# EAGLE schematic dualwbo (EAGLE 9.1.1)

## Sheet 1 of 8: MCU
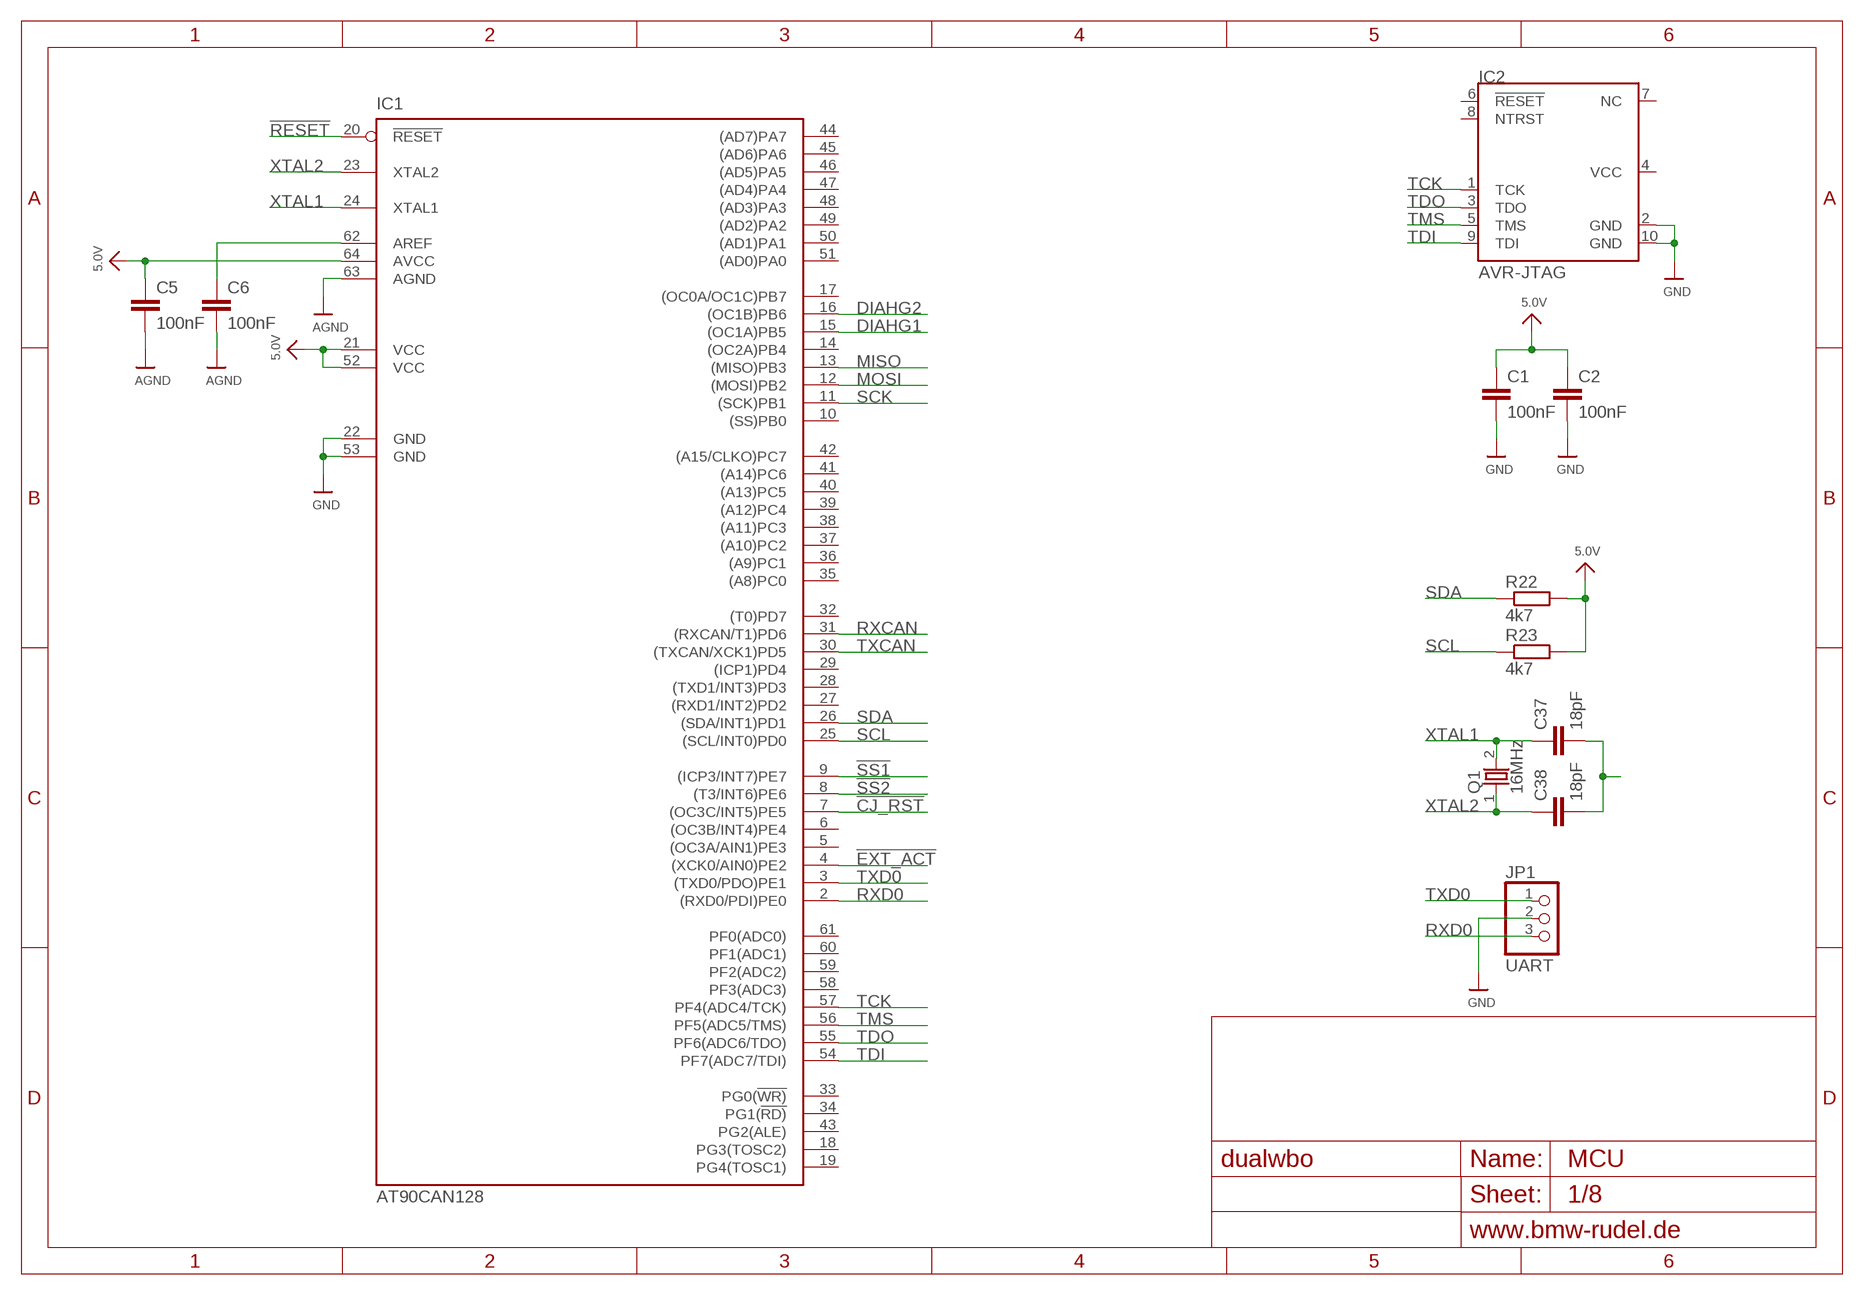
[diagram p0: schematic, sheet 1]

### Parts
C1  100nF  C-EUC0805  [C0805]
C2  100nF  C-EUC0805  [C0805]
C5  100nF  C-EUC0805  [C0805]
C6  100nF  C-EUC0805  [C0805]
C37  18pF  C-EUC0805  [C0805]
C38  18pF  C-EUC0805  [C0805]
IC1  AT90CAN128  [TQFP64]
IC2  AVR-JTAG  [2X05_1.27MM_SMT]
JP1  UART  PINHD-1X3  [1X03]
Q1  16MHz  ABM7  [ABM7]
R22  4k7  R-EU_R0805  [R0805]
R23  4k7  R-EU_R0805  [R0805]

### Nets
5.0V: C1.1 C2.1 C5.1 IC1.21(VCC) IC1.52(VCC) IC1.64(AVCC) R22.2 R23.2 ; also sheet 2,3,5,6,7
!CJ_RST: IC1.7((OC3C/INT5)PE5) ; also sheet 5,6
!EXT_ACT: IC1.4((XCK0/AIN0)PE2) ; also sheet 3
!RESET: IC1.20(!RESET) ; also sheet 3
!SS1: IC1.9((ICP3/INT7)PE7) ; also sheet 5
!SS2: IC1.8((T3/INT6)PE6) ; also sheet 6
AGND: C5.2 C6.2 IC1.63(AGND) ; also sheet 3,5,6,7
DIAHG1: IC1.15((OC1A)PB5) ; also sheet 4,5
DIAHG2: IC1.16((OC1B)PB6) ; also sheet 4,6
GND: C1.2 C2.2 IC1.22(GND) IC1.53(GND) IC2.2(GND) IC2.10(GND) JP1.2 ; also sheet 2,3,4,5,6,7,8
MISO: IC1.13((MISO)PB3) ; also sheet 5,6
MOSI: IC1.12((MOSI)PB2) ; also sheet 5,6
N$26: C6.1 IC1.62(AREF)
N$30: C37.2 C38.2
RXCAN: IC1.31((RXCAN/T1)PD6) ; also sheet 2
RXD0: IC1.2((RXD0/PDI)PE0) JP1.3
SCK: IC1.11((SCK)PB1) ; also sheet 5,6
SCL: IC1.25((SCL/INT0)PD0) R23.1 ; also sheet 7
SDA: IC1.26((SDA/INT1)PD1) R22.1 ; also sheet 7
TCK: IC1.57(PF4(ADC4/TCK)) IC2.1(TCK)
TDI: IC1.54(PF7(ADC7/TDI)) IC2.9(TDI)
TDO: IC1.55(PF6(ADC6/TDO)) IC2.3(TDO)
TMS: IC1.56(PF5(ADC5/TMS)) IC2.5(TMS)
TXCAN: IC1.30((TXCAN/XCK1)PD5) ; also sheet 2
TXD0: IC1.3((TXD0/PDO)PE1) JP1.1
XTAL1: C37.1 IC1.24(XTAL1) Q1.2
XTAL2: C38.1 IC1.23(XTAL2) Q1.1
Unconnected: IC1.5((OC3A/AIN1)PE3) IC1.6((OC3B/INT4)PE4) IC1.10((SS)PB0) IC1.14((OC2A)PB4) IC1.17((OC0A/OC1C)PB7) IC1.18(PG3(TOSC2)) IC1.19(PG4(TOSC1)) IC1.27((RXD1/INT2)PD2) IC1.28((TXD1/INT3)PD3) IC1.29((ICP1)PD4) IC1.32((T0)PD7) IC1.33(PG0(!WR)) IC1.34(PG1(!RD)) IC1.35((A8)PC0) IC1.36((A9)PC1) IC1.37((A10)PC2) IC1.38((A11)PC3) IC1.39((A12)PC4) IC1.40((A13)PC5) IC1.41((A14)PC6) IC1.42((A15/CLKO)PC7) IC1.43(PG2(ALE)) IC1.44((AD7)PA7) IC1.45((AD6)PA6) IC1.46((AD5)PA5) IC1.47((AD4)PA4) IC1.48((AD3)PA3) IC1.49((AD2)PA2) IC1.50((AD1)PA1) IC1.51((AD0)PA0) IC1.58(PF3(ADC3)) IC1.59(PF2(ADC2)) IC1.60(PF1(ADC1)) IC1.61(PF0(ADC0)) IC2.4(VCC) IC2.6(!RESET) IC2.7(NC) IC2.8(NTRST)

## Sheet 2 of 8: CAN
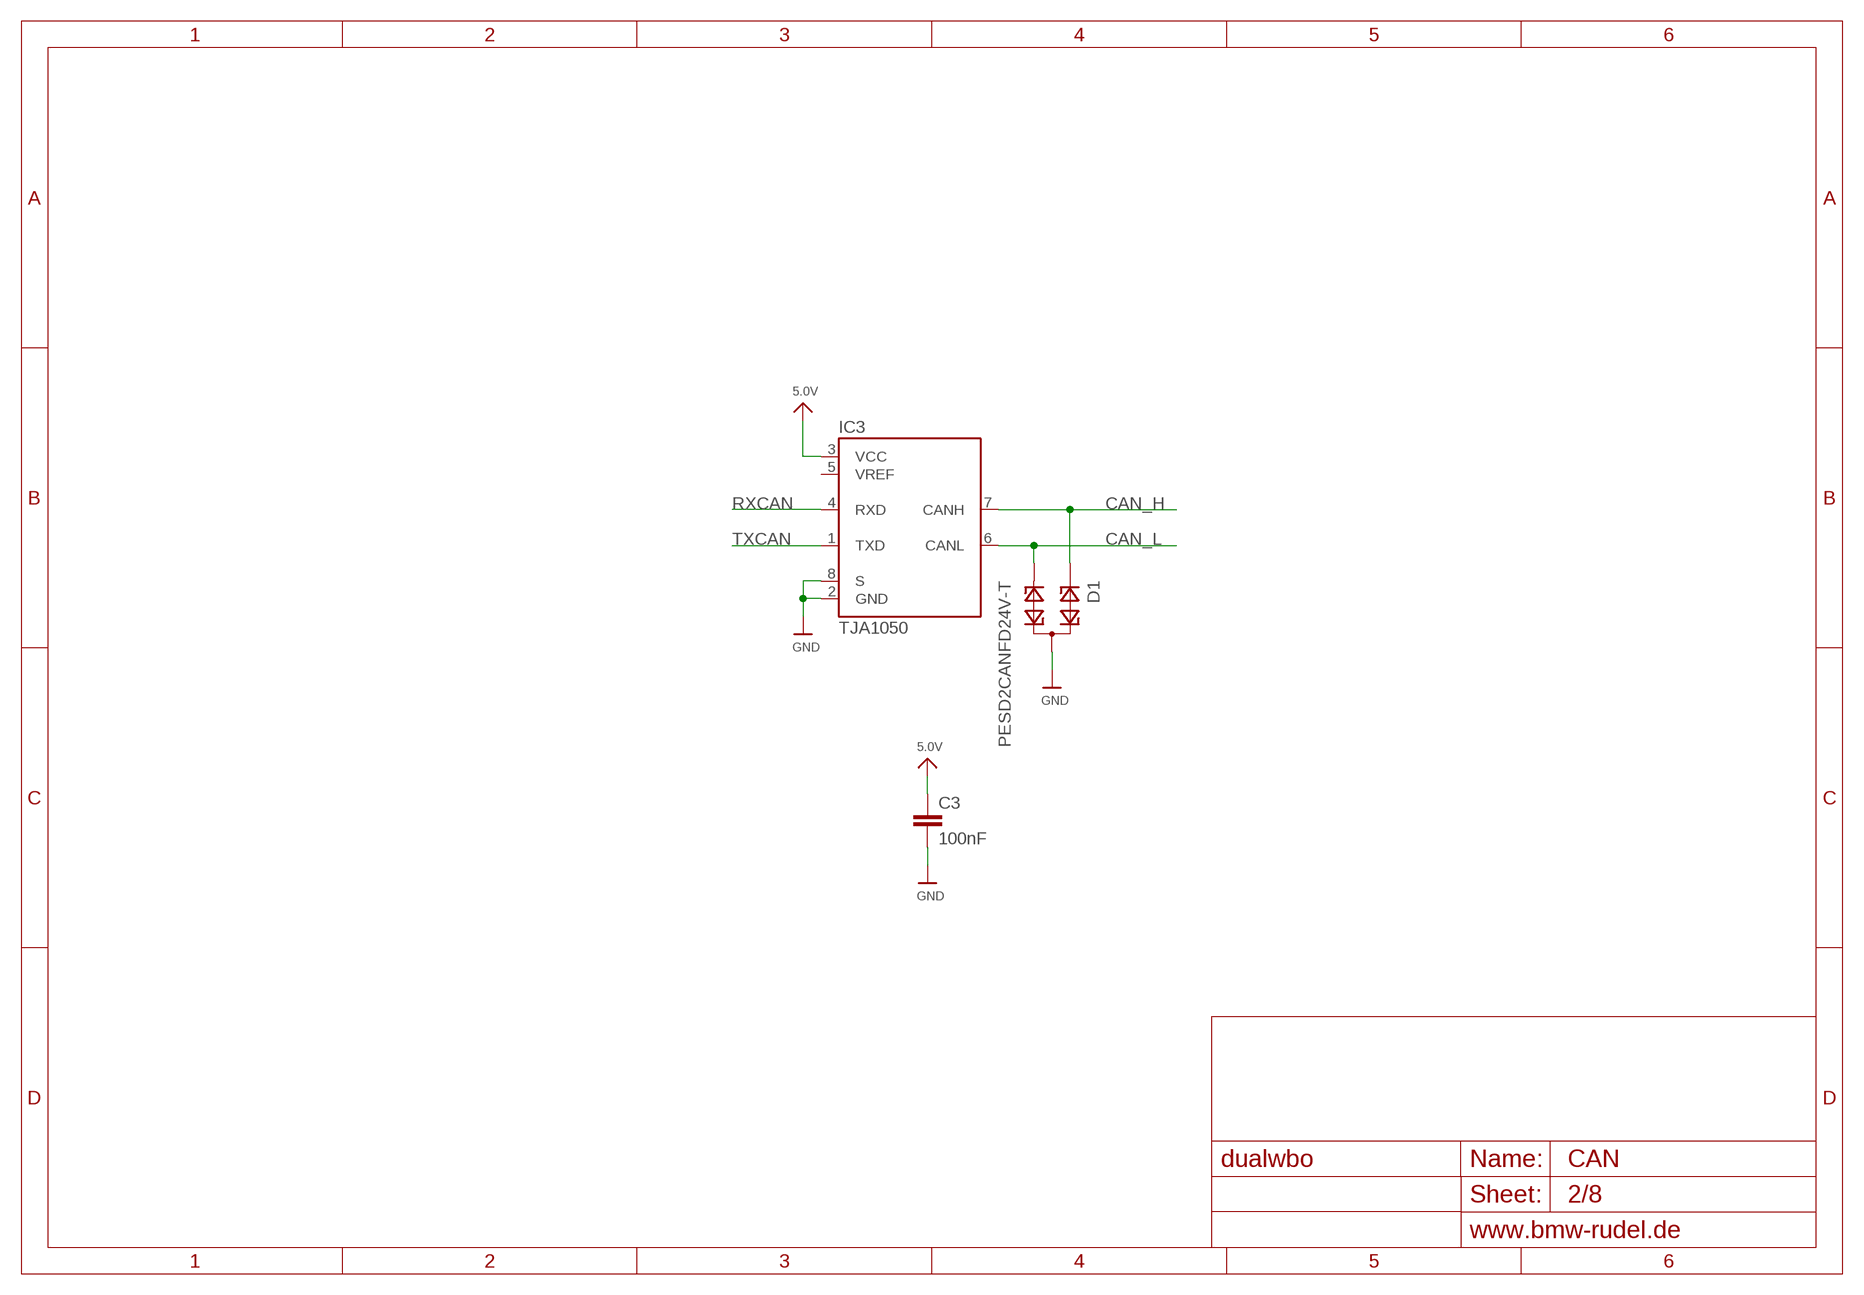
[diagram p1: schematic, sheet 2]

### Parts
C3  100nF  C-EUC0805  [C0805]
D1  PESD2CANFD24V-T  [SOT23]
IC3  TJA1050  [SO8]

### Nets
5.0V: C3.1 IC3.3(VCC) ; also sheet 1,3,5,6,7
CAN_H: D1.1 IC3.7(CANH) ; also sheet 8
CAN_L: D1.2 IC3.6(CANL) ; also sheet 8
GND: C3.2 D1.3 IC3.2(GND) IC3.8(S) ; also sheet 1,3,4,5,6,7,8
RXCAN: IC3.4(RXD) ; also sheet 1
TXCAN: IC3.1(TXD) ; also sheet 1
Unconnected: IC3.5(VREF)

## Sheet 3 of 8: POWER
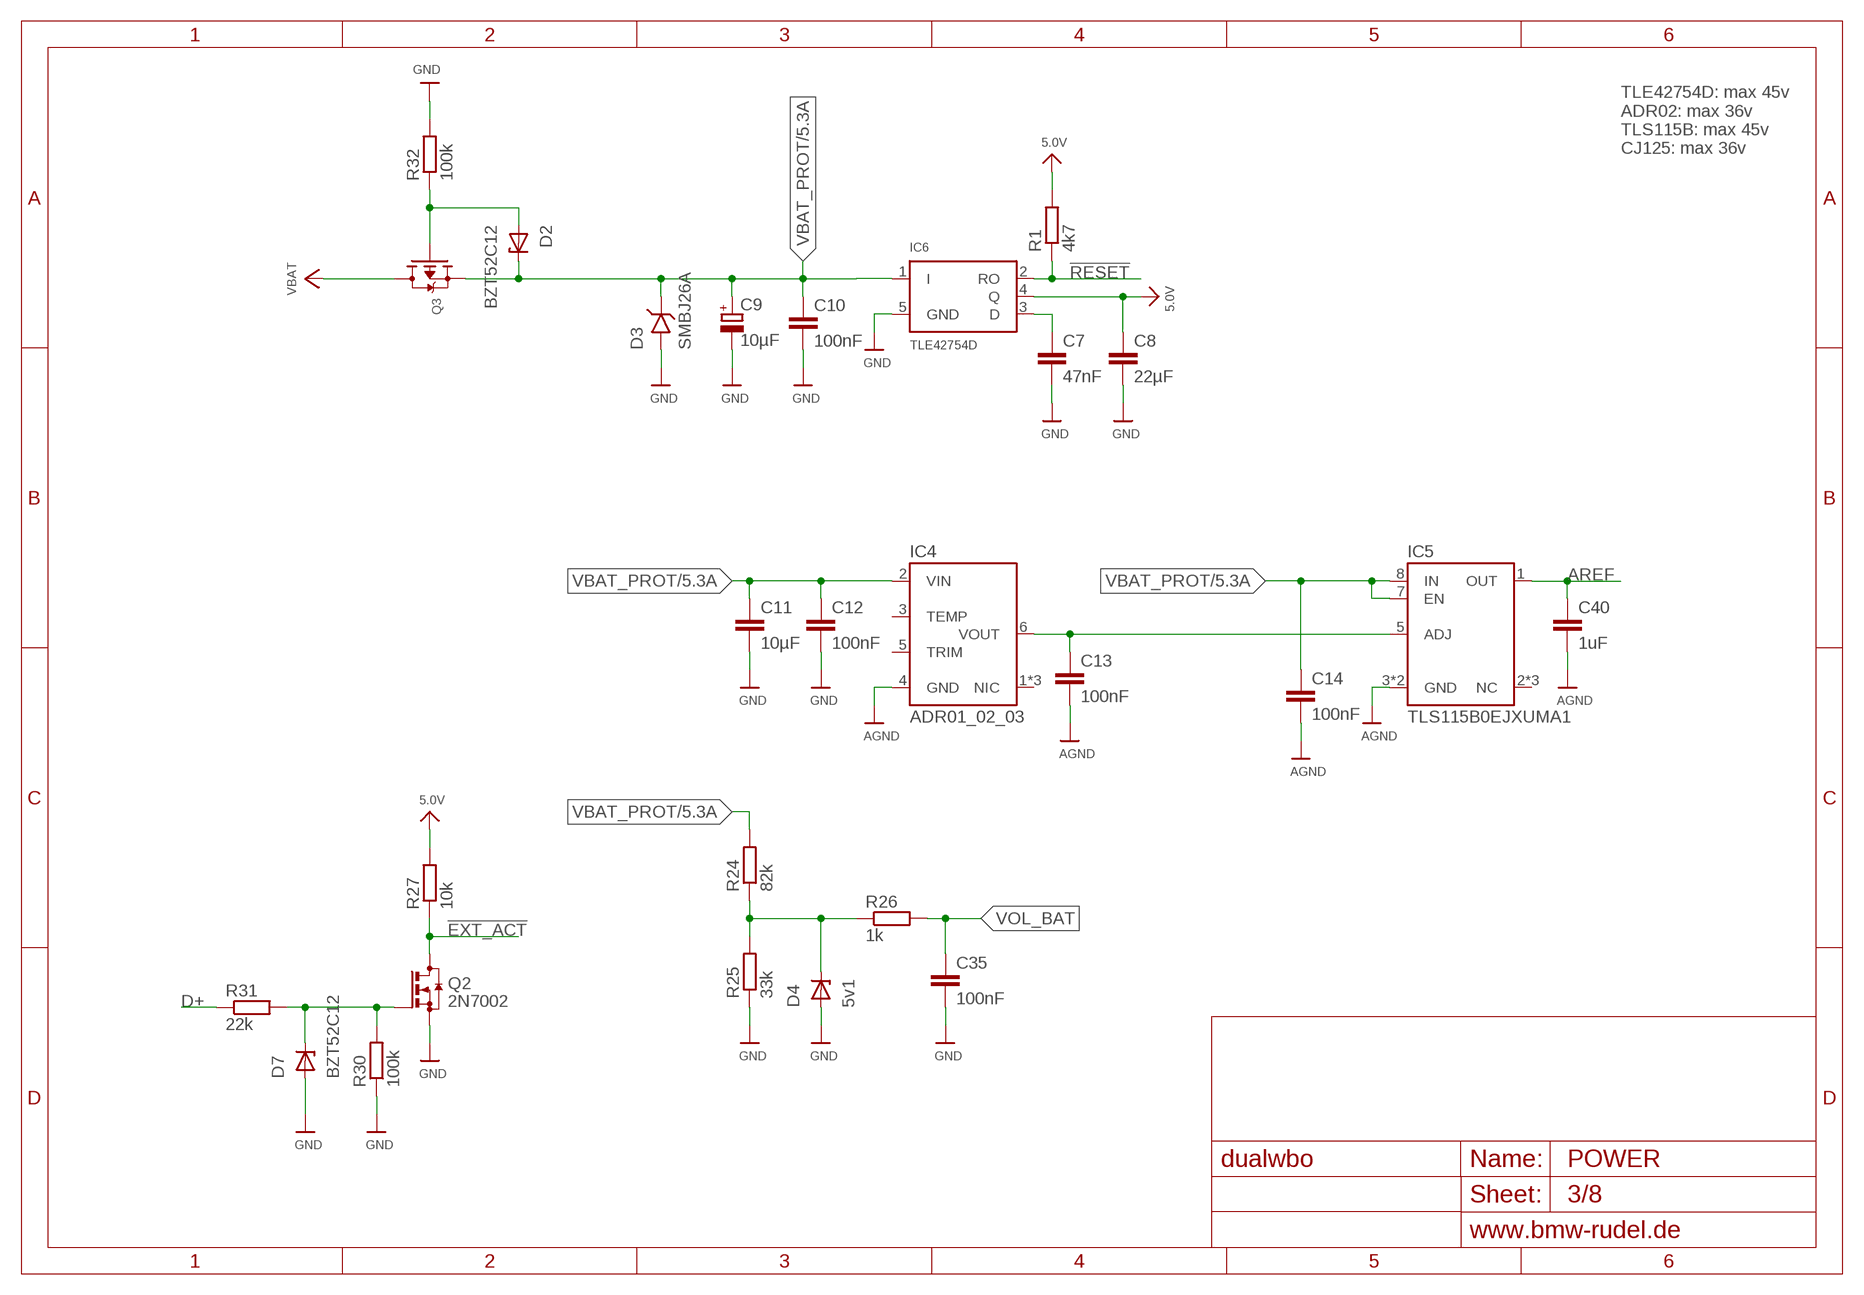
[diagram p2: schematic, sheet 3]

### Parts
C7  47nF  C-EUC0805  [C0805]
C8  22µF  C-EUC0805  [C0805]
C9  10µF  CPOL-EUD  [PANASONIC_D]
C10  100nF  C-EUC0805  [C0805]
C11  10µF  C-EUC0805  [C0805]
C12  100nF  C-EUC0805  [C0805]
C13  100nF  C-EUC0805  [C0805]
C14  100nF  C-EUC0805  [C0805]
C35  100nF  C-EUC0805  [C0805]
C40  1uF  C-EUC0805  [C0805]
D2  BZT52C12  Z-DIODESOD123  [SOD-123]
D3  SMBJ26A  P6SMBXXASMB  [DO-214AA]
D4  5v1  Z-DIODESMB  [SMB]
D7  BZT52C12  Z-DIODESOD123  [SOD-123]
IC4  ADR01_02_03  [SOIC8]
IC5  TLS115B0EJXUMA1  [PG-DSO-8]
IC6  TLE42754D  [TO252-51]
Q2  2N7002  BSS123  [SOT-23]
Q3  MOSFET-P  [SOT23-R]
R1  4k7  R-EU_R0805  [R0805]
R24  82k  R-EU_R0805  [R0805]
R25  33k  R-EU_R0805  [R0805]
R26  1k  R-EU_R0805  [R0805]
R27  10k  R-EU_R0805  [R0805]
R30  100k  R-EU_R0805  [R0805]
R31  22k  R-EU_R0805  [R0805]
R32  100k  R-EU_R0805  [R0805]

### Nets
5.0V: C8.1 IC6.4(Q) R1.2 R27.2 ; also sheet 1,2,5,6,7
!EXT_ACT: Q2.3(D) R27.1 ; also sheet 1
!RESET: IC6.2(RO) R1.1 ; also sheet 1
AGND: C13.2 C14.2 C40.2 IC4.4(GND) IC5.3(GND) IC5.9(GND) ; also sheet 1,5,6,7
AREF: C40.1 IC5.1(OUT) ; also sheet 5,6,7
D+: R31.1 ; also sheet 8
GND: C7.2 C8.2 C9.- C10.2 C11.2 C12.2 C35.2 D3.P$2(A) D4.A D7.A IC6.5(GND) Q2.2(S) R25.1 R30.1 R32.2 ; also sheet 1,2,4,5,6,7,8
N$1: C13.1 IC4.6(VOUT) IC5.5(ADJ)
N$4: C7.1 IC6.3(D)
N$28: D4.C R24.1 R25.2 R26.1
N$29: D7.C Q2.1(G) R30.2 R31.2
N$32: D2.A Q3.1(G) R32.1
VBAT: Q3.3(D) ; also sheet 8
VBAT_PROT: C9.+ C10.1 C11.1 C12.1 C14.1 D2.C D3.P$1(C) IC4.2(VIN) IC5.7(EN) IC5.8(IN) IC6.1(I) Q3.2(S) R24.2 ; also sheet 5,6
VOL_BAT: C35.1 R26.2 ; also sheet 7
Unconnected: IC4.1(NIC) IC4.3(TEMP) IC4.5(TRIM) IC4.7(NIC) IC4.8(NIC) IC5.2(NC) IC5.4(NC) IC5.6(NC)

### Notes on the sheet
- TLE42754D: max 45v
  ADR02: max 36v
  TLS115B: max 45v
  CJ125: max 36v

## Sheet 4 of 8: HEATER
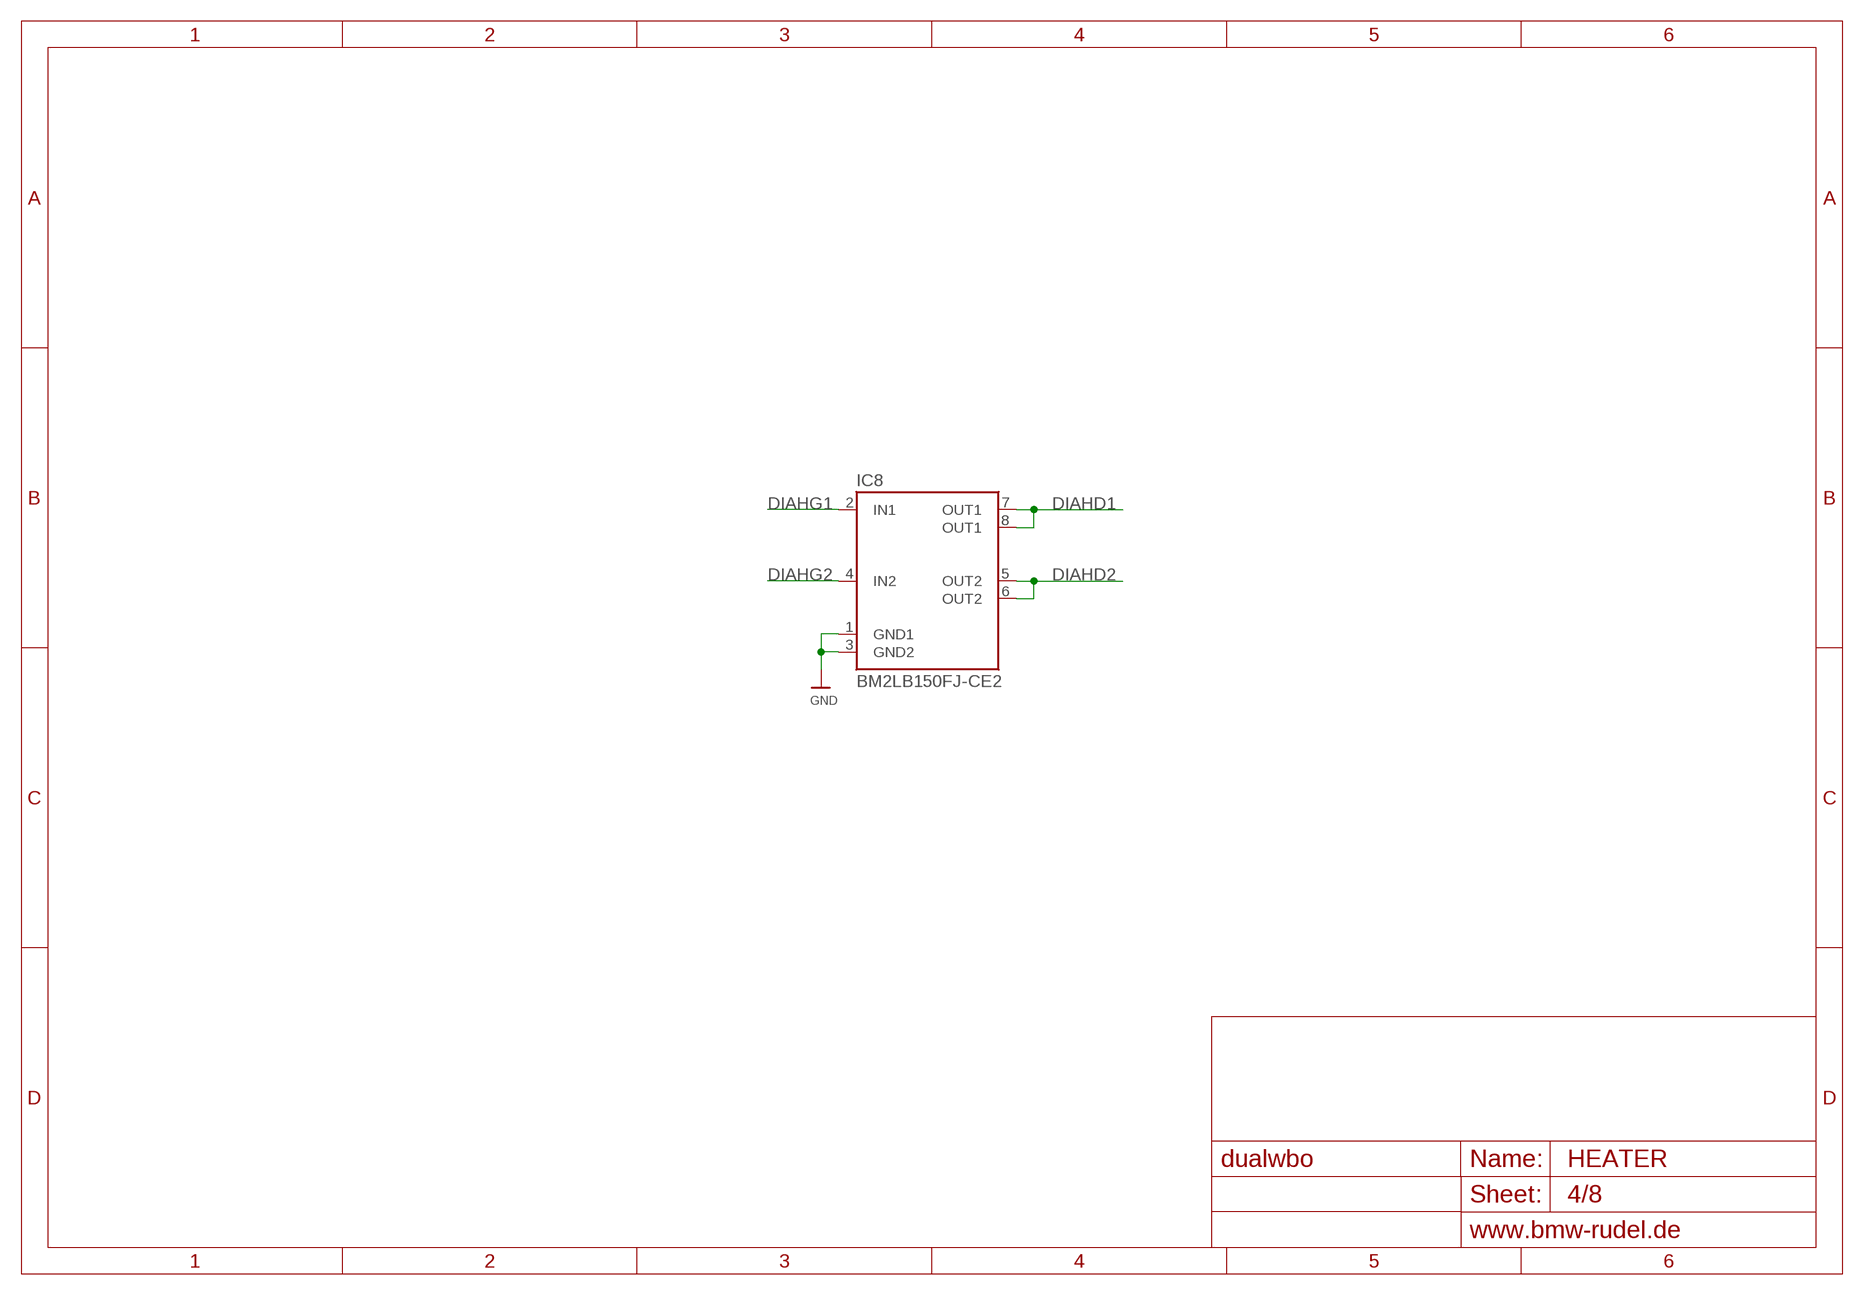
[diagram p3: schematic, sheet 4]

### Parts
IC8  BM2LB150FJ-CE2  [SOIC127P600X165-8N]

### Nets
DIAHD1: IC8.7(OUT1) IC8.8(OUT1) ; also sheet 5
DIAHD2: IC8.5(OUT2) IC8.6(OUT2) ; also sheet 6
DIAHG1: IC8.2(IN1) ; also sheet 1,5
DIAHG2: IC8.4(IN2) ; also sheet 1,6
GND: IC8.1(GND1) IC8.3(GND2) ; also sheet 1,2,3,5,6,7,8

## Sheet 5 of 8: CJ125#1
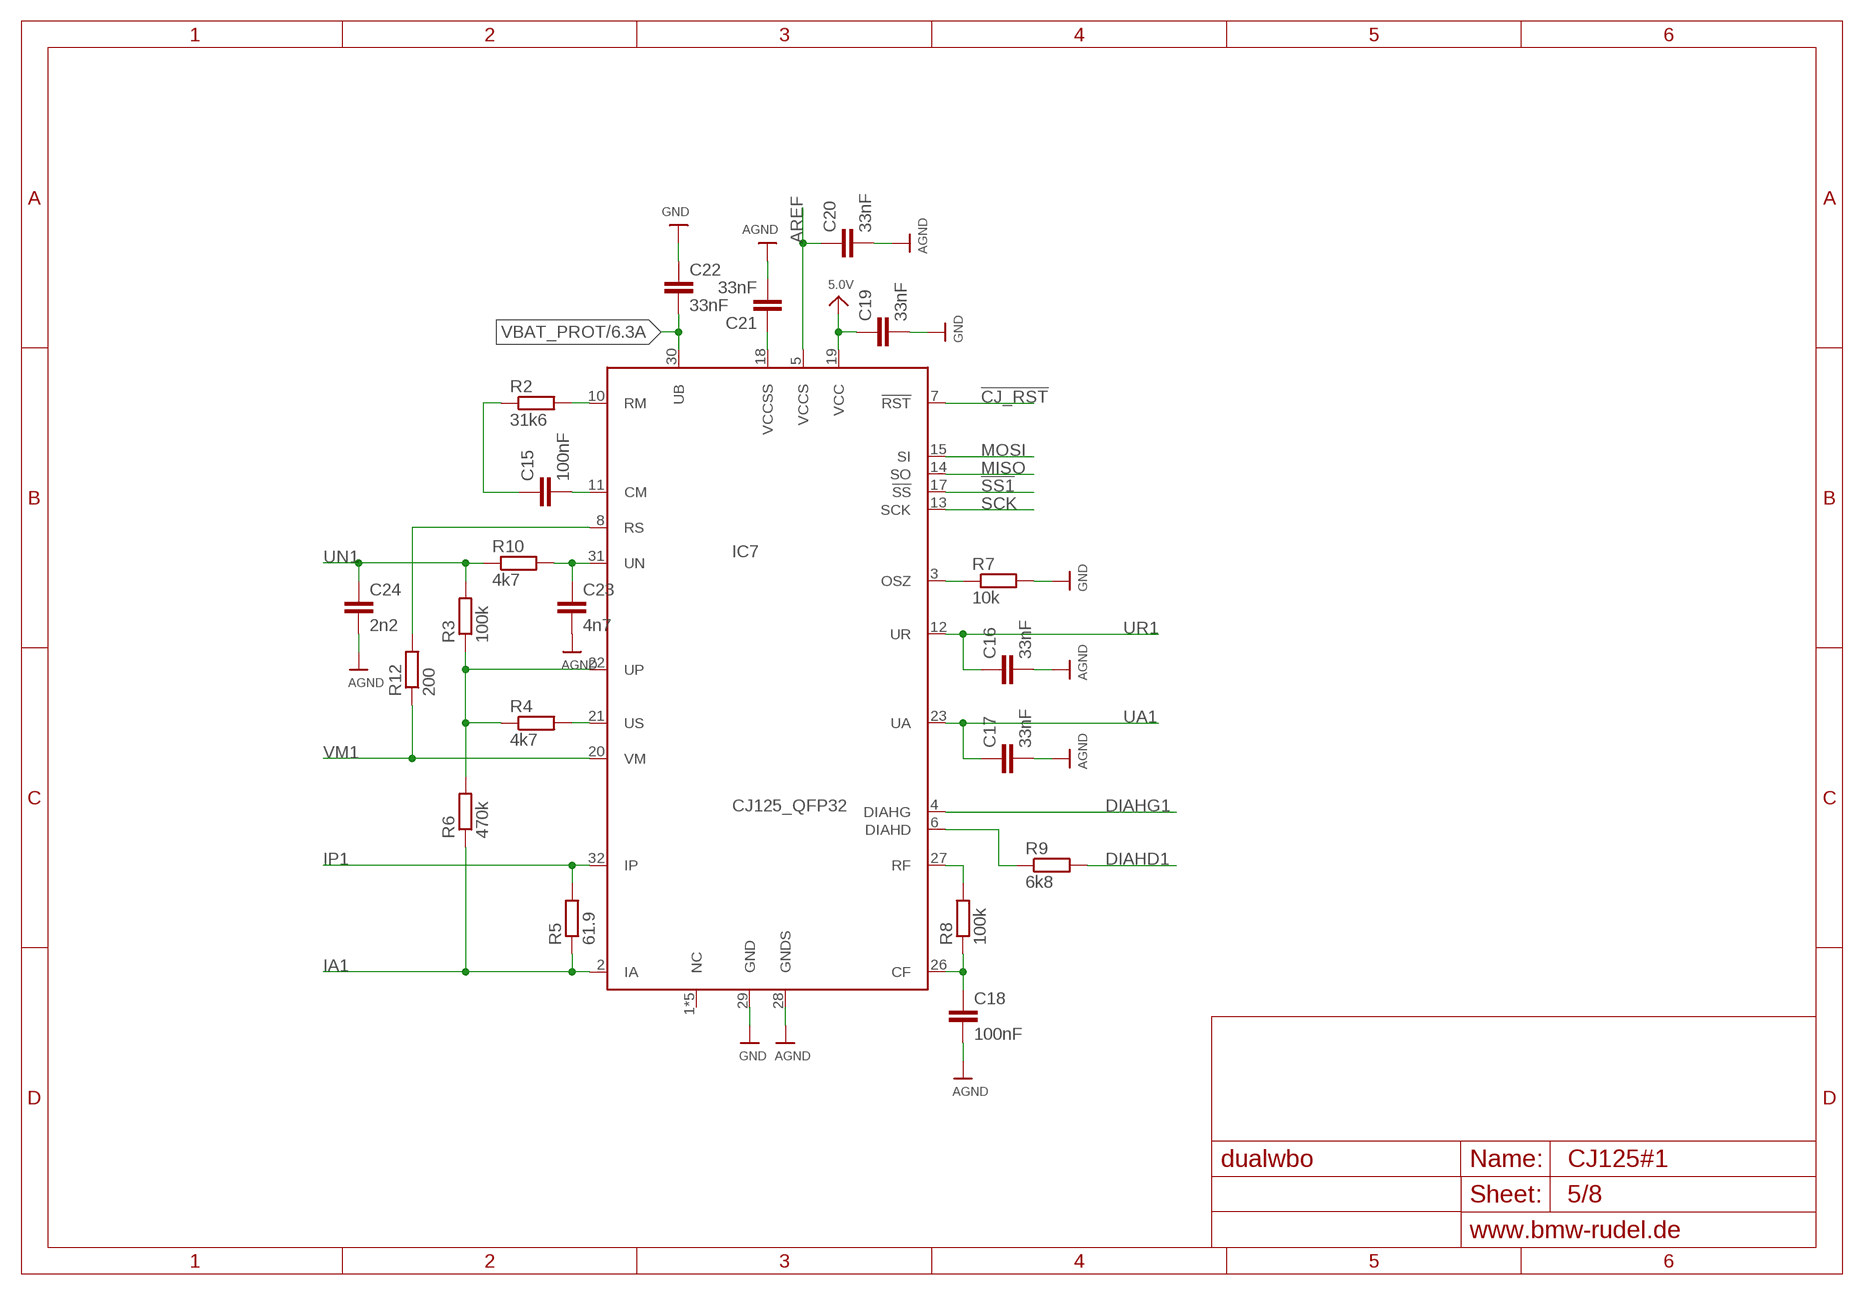
[diagram p4: schematic, sheet 5]

### Parts
C15  100nF  C-EUC0805  [C0805]
C16  33nF  C-EUC0805  [C0805]
C17  33nF  C-EUC0805  [C0805]
C18  100nF  C-EUC0805  [C0805]
C19  33nF  C-EUC0805  [C0805]
C20  33nF  C-EUC0805  [C0805]
C21  33nF  C-EUC0805  [C0805]
C22  33nF  C-EUC0805  [C0805]
C23  4n7  C-EUC0805  [C0805]
C24  2n2  C-EUC0805  [C0805]
IC7  CJ125_QFP32  [TQFP32-08]
R2  31k6  R-EU_R0805  [R0805]
R3  100k  R-EU_R0805  [R0805]
R4  4k7  R-EU_R0805  [R0805]
R5  61.9  R-EU_R0805  [R0805]
R6  470k  R-EU_R0805  [R0805]
R7  10k  R-EU_R0805  [R0805]
R8  100k  R-EU_R0805  [R0805]
R9  6k8  R-EU_R0805  [R0805]
R10  4k7  R-EU_R0805  [R0805]
R12  200  R-EU_R0805  [R0805]

### Nets
5.0V: C19.1 IC7.19(VCC) ; also sheet 1,2,3,6,7
!CJ_RST: IC7.7(!RST) ; also sheet 1,6
!SS1: IC7.17(!SS) ; also sheet 1
AGND: C16.2 C17.2 C18.2 C20.2 C21.2 C23.2 C24.2 IC7.28(GNDS) ; also sheet 1,3,6,7
AREF: C20.1 IC7.5(VCCS) ; also sheet 3,6,7
DIAHD1: R9.2 ; also sheet 4
DIAHG1: IC7.4(DIAHG) ; also sheet 1,4
GND: C19.2 C22.1 IC7.29(GND) R7.2 ; also sheet 1,2,3,4,6,7,8
IA1: IC7.2(IA) R5.1 R6.1
IP1: IC7.32(IP) R5.2
MISO: IC7.14(SO) ; also sheet 1,6
MOSI: IC7.15(SI) ; also sheet 1,6
N$2: IC7.10(RM) R2.2
N$3: C15.1 R2.1
N$5: C15.2 IC7.11(CM)
N$6: IC7.3(OSZ) R7.1
N$7: IC7.27(RF) R8.2
N$8: IC7.21(US) R4.2
N$9: IC7.22(UP) R3.1 R4.1 R6.2
N$10: C18.1 IC7.26(CF) R8.1
N$11: IC7.8(RS) R12.2
N$12: C23.1 IC7.31(UN) R10.2
N$13: IC7.6(DIAHD) R9.1
N$14: C21.1 IC7.18(VCCSS)
SCK: IC7.13(SCK) ; also sheet 1,6
UA1: C17.1 IC7.23(UA) ; also sheet 7
UN1: C24.1 R3.2 R10.1
UR1: C16.1 IC7.12(UR) ; also sheet 7
VBAT_PROT: C22.2 IC7.30(UB) ; also sheet 3,6
VM1: IC7.20(VM) R12.1
Unconnected: IC7.1(NC) IC7.9(NC) IC7.16(NC) IC7.24(NC) IC7.25(NC)

## Sheet 6 of 8: CJ125#2
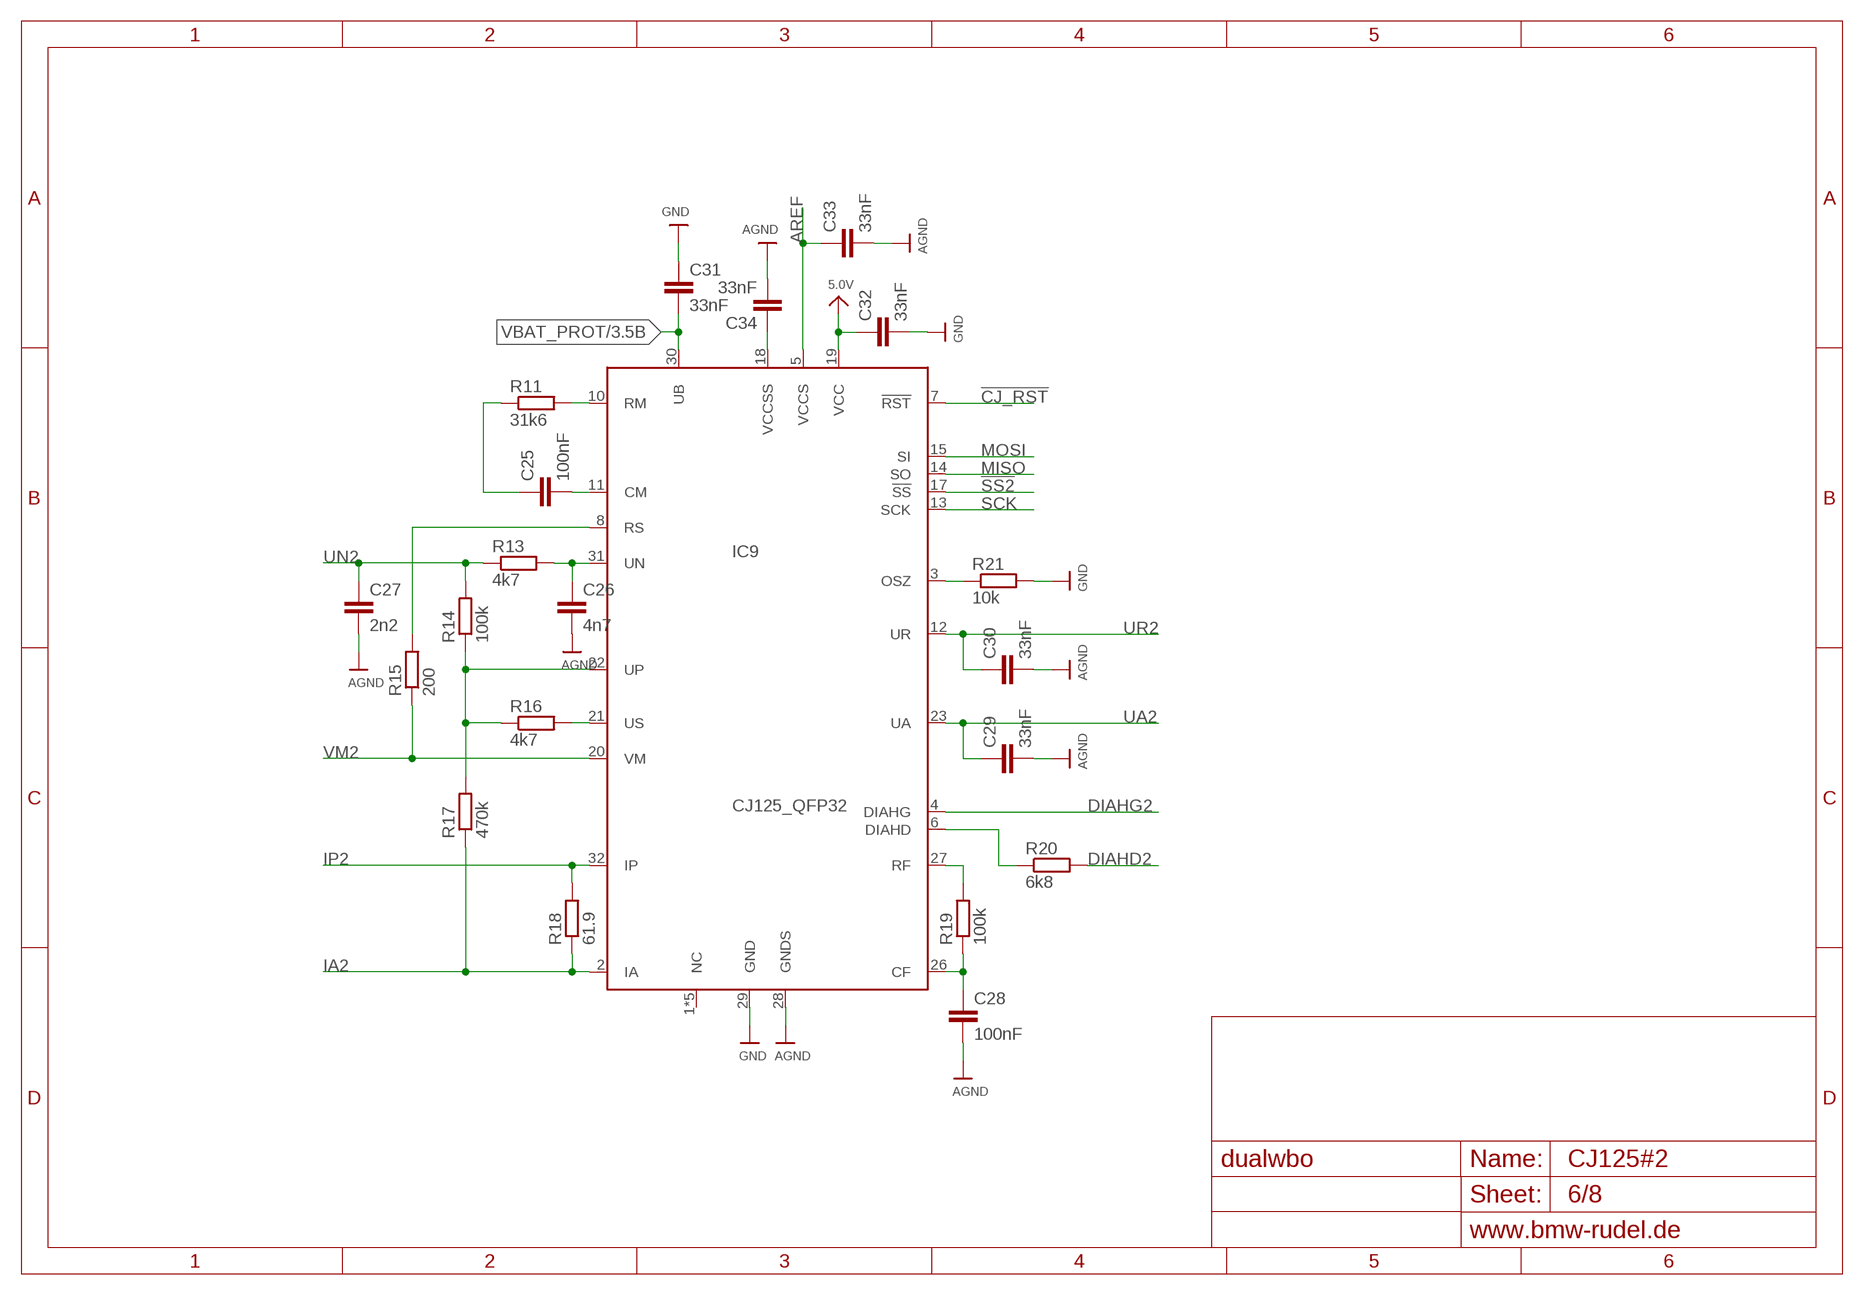
[diagram p5: schematic, sheet 6]

### Parts
C25  100nF  C-EUC0805  [C0805]
C26  4n7  C-EUC0805  [C0805]
C27  2n2  C-EUC0805  [C0805]
C28  100nF  C-EUC0805  [C0805]
C29  33nF  C-EUC0805  [C0805]
C30  33nF  C-EUC0805  [C0805]
C31  33nF  C-EUC0805  [C0805]
C32  33nF  C-EUC0805  [C0805]
C33  33nF  C-EUC0805  [C0805]
C34  33nF  C-EUC0805  [C0805]
IC9  CJ125_QFP32  [TQFP32-08]
R11  31k6  R-EU_R0805  [R0805]
R13  4k7  R-EU_R0805  [R0805]
R14  100k  R-EU_R0805  [R0805]
R15  200  R-EU_R0805  [R0805]
R16  4k7  R-EU_R0805  [R0805]
R17  470k  R-EU_R0805  [R0805]
R18  61.9  R-EU_R0805  [R0805]
R19  100k  R-EU_R0805  [R0805]
R20  6k8  R-EU_R0805  [R0805]
R21  10k  R-EU_R0805  [R0805]

### Nets
5.0V: C32.1 IC9.19(VCC) ; also sheet 1,2,3,5,7
!CJ_RST: IC9.7(!RST) ; also sheet 1,5
!SS2: IC9.17(!SS) ; also sheet 1
AGND: C26.2 C27.2 C28.2 C29.2 C30.2 C33.2 C34.2 IC9.28(GNDS) ; also sheet 1,3,5,7
AREF: C33.1 IC9.5(VCCS) ; also sheet 3,5,7
DIAHD2: R20.2 ; also sheet 4
DIAHG2: IC9.4(DIAHG) ; also sheet 1,4
GND: C31.1 C32.2 IC9.29(GND) R21.2 ; also sheet 1,2,3,4,5,7,8
IA2: IC9.2(IA) R17.1 R18.1
IP2: IC9.32(IP) R18.2
MISO: IC9.14(SO) ; also sheet 1,5
MOSI: IC9.15(SI) ; also sheet 1,5
N$15: IC9.10(RM) R11.2
N$16: C25.1 R11.1
N$17: C25.2 IC9.11(CM)
N$18: IC9.8(RS) R15.2
N$19: C26.1 IC9.31(UN) R13.2
N$20: IC9.22(UP) R14.1 R16.1 R17.2
N$21: IC9.27(RF) R19.2
N$22: IC9.21(US) R16.2
N$23: IC9.6(DIAHD) R20.1
N$24: IC9.3(OSZ) R21.1
N$25: C28.1 IC9.26(CF) R19.1
N$27: C34.1 IC9.18(VCCSS)
SCK: IC9.13(SCK) ; also sheet 1,5
UA2: C29.1 IC9.23(UA) ; also sheet 7
UN2: C27.1 R13.1 R14.2
UR2: C30.1 IC9.12(UR) ; also sheet 7
VBAT_PROT: C31.2 IC9.30(UB) ; also sheet 3,5
VM2: IC9.20(VM) R15.1
Unconnected: IC9.1(NC) IC9.9(NC) IC9.16(NC) IC9.24(NC) IC9.25(NC)

## Sheet 7 of 8: ADC
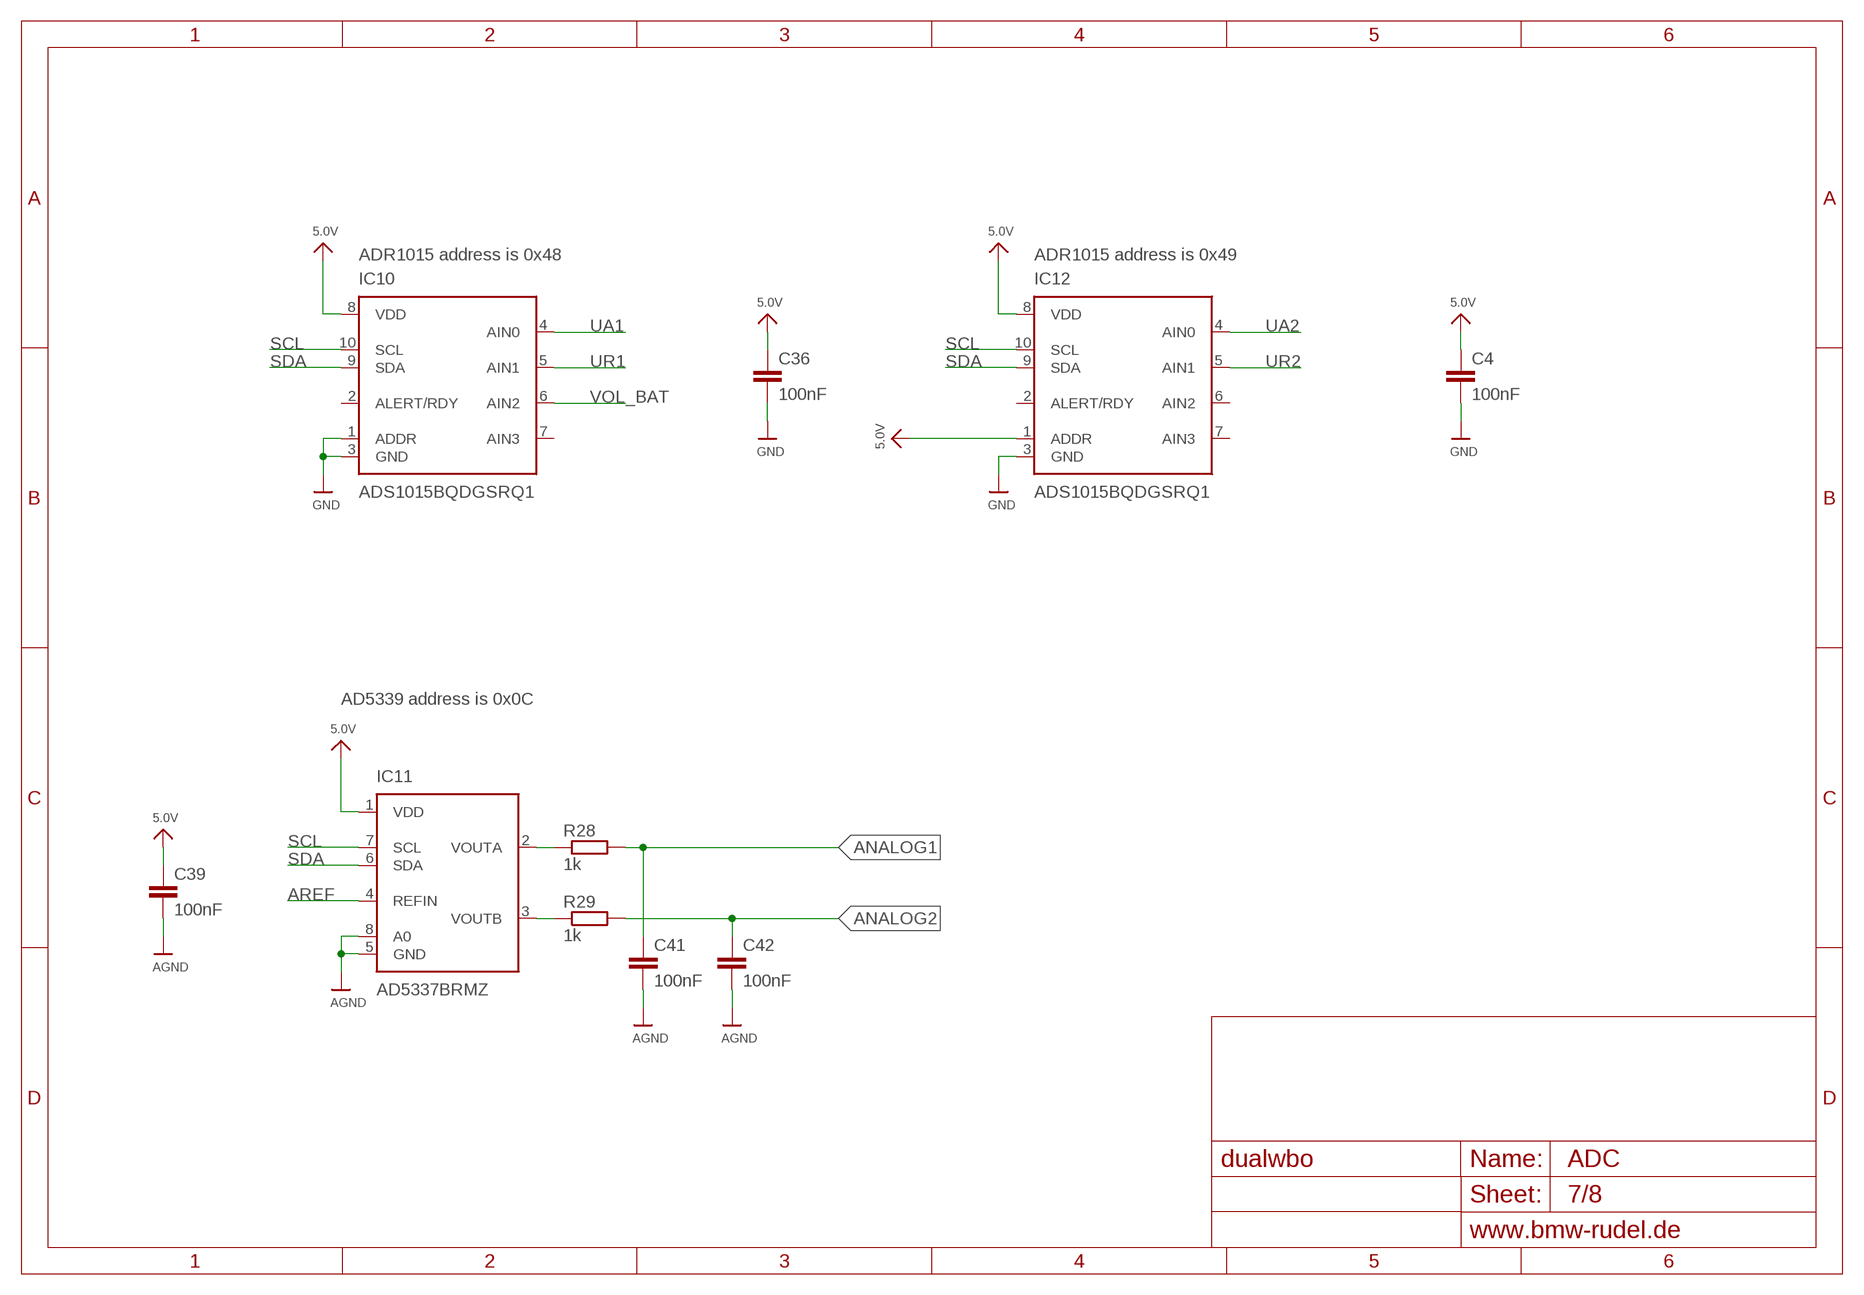
[diagram p6: schematic, sheet 7]

### Parts
C4  100nF  C-EUC0805  [C0805]
C36  100nF  C-EUC0805  [C0805]
C39  100nF  C-EUC0805  [C0805]
C41  100nF  C-EUC0805  [C0805]
C42  100nF  C-EUC0805  [C0805]
IC10  ADS1015BQDGSRQ1  [SOP50P490X110-10N]
IC11  AD5337BRMZ  [SOP65P490X110-8N]
IC12  ADS1015BQDGSRQ1  [SOP50P490X110-10N]
R28  1k  R-EU_R0805  [R0805]
R29  1k  R-EU_R0805  [R0805]

### Nets
5.0V: C4.1 C36.1 C39.1 IC10.8(VDD) IC11.1(VDD) IC12.1(ADDR) IC12.8(VDD) ; also sheet 1,2,3,5,6
AGND: C39.2 C41.2 C42.2 IC11.5(GND) IC11.8(A0) ; also sheet 1,3,5,6
ANALOG1: C41.1 R28.2 ; also sheet 8
ANALOG2: C42.1 R29.2 ; also sheet 8
AREF: IC11.4(REFIN) ; also sheet 3,5,6
GND: C4.2 C36.2 IC10.1(ADDR) IC10.3(GND) IC12.3(GND) ; also sheet 1,2,3,4,5,6,8
N$31: IC11.2(VOUTA) R28.1
N$34: IC11.3(VOUTB) R29.1
SCL: IC10.10(SCL) IC11.7(SCL) IC12.10(SCL) ; also sheet 1
SDA: IC10.9(SDA) IC11.6(SDA) IC12.9(SDA) ; also sheet 1
UA1: IC10.4(AIN0) ; also sheet 5
UA2: IC12.4(AIN0) ; also sheet 6
UR1: IC10.5(AIN1) ; also sheet 5
UR2: IC12.5(AIN1) ; also sheet 6
VOL_BAT: IC10.6(AIN2) ; also sheet 3
Unconnected: IC10.2(ALERT/RDY) IC10.7(AIN3) IC12.2(ALERT/RDY) IC12.6(AIN2) IC12.7(AIN3)

### Notes on the sheet
- ADR1015 address is 0x48 | ADR1015 address is 0x49
- AD5339 address is 0x0C

## Sheet 8 of 8: Housing
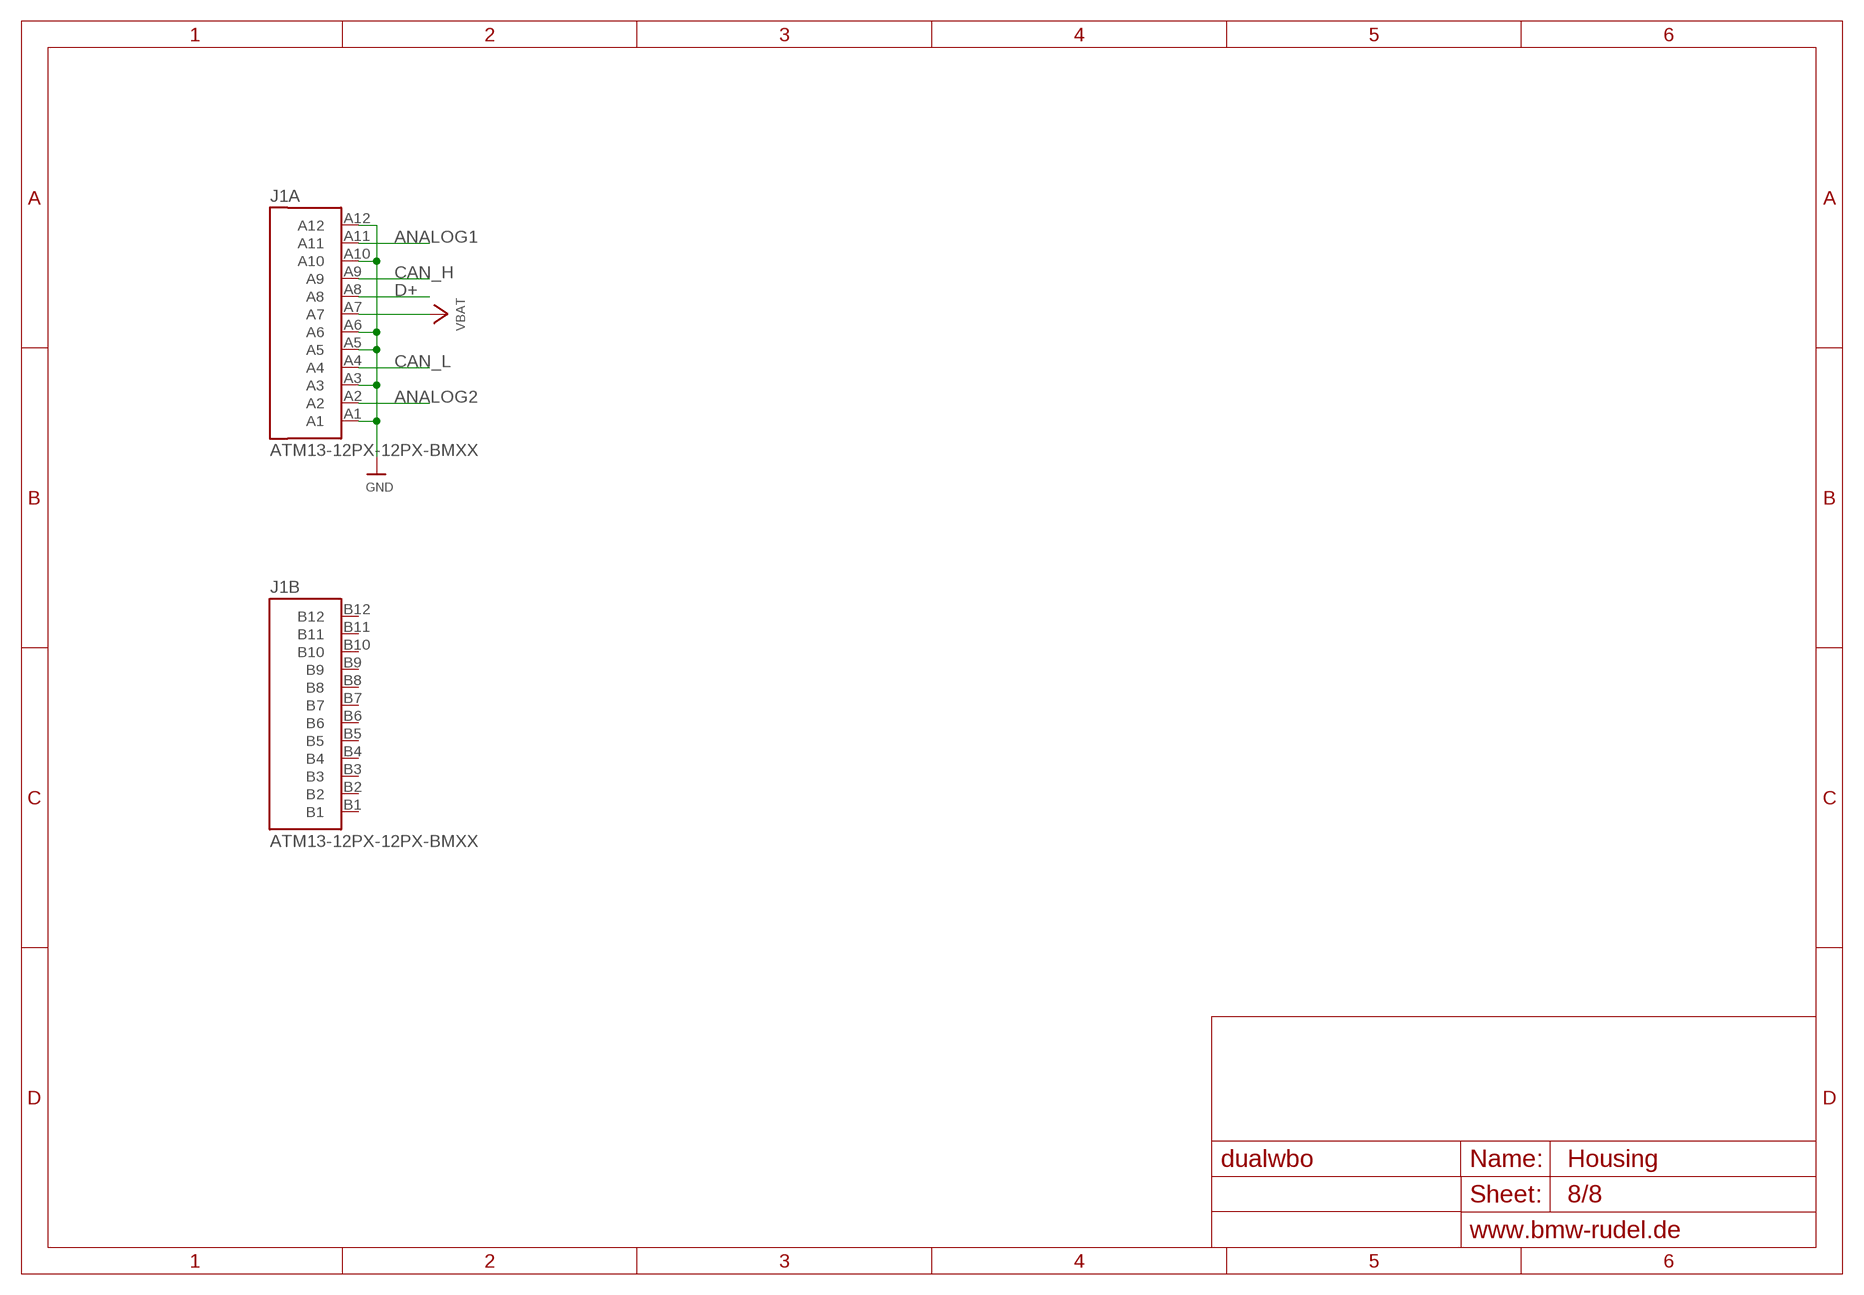
[diagram p7: schematic, sheet 8]

### Parts
J1  ATM13-12PX-12PX-BMXX  [ATM13-12PX-12PX-BMXX]

### Nets
ANALOG1: J1.A11(A:A11) ; also sheet 7
ANALOG2: J1.A2(A:A2) ; also sheet 7
CAN_H: J1.A9(A:A9) ; also sheet 2
CAN_L: J1.A4(A:A4) ; also sheet 2
D+: J1.A8(A:A8) ; also sheet 3
GND: J1.A1(A:A1) J1.A3(A:A3) J1.A5(A:A5) J1.A6(A:A6) J1.A10(A:A10) J1.A12(A:A12) ; also sheet 1,2,3,4,5,6,7
VBAT: J1.A7(A:A7) ; also sheet 3
Unconnected: J1.B1(B:B1) J1.B2(B:B2) J1.B3(B:B3) J1.B4(B:B4) J1.B5(B:B5) J1.B6(B:B6) J1.B7(B:B7) J1.B8(B:B8) J1.B9(B:B9) J1.B10(B:B10) J1.B11(B:B11) J1.B12(B:B12)

## Library data of the parts
C1-C8 C10-C42 = rcl:C-EU: CAPACITOR, European symbol; SPICEPREFIX: C
C9 = rcl:CPOL-EU: POLARIZED CAPACITOR, European symbol; SPICEPREFIX: C
D1 = Heinrich:PESD2CANFD24V-T: CAN bus ESD protection diode Source: https://assets.nexperia.com/documents/data-sheet/PESD2CANFD24V-T.pdf
D2 D7 = Heinrich:Z-DIODE
D3 = Heinrich:P6SMBXXA: SMBxxAT3G TVS Diode The SMB series is designed to protect voltage sensitive components from high voltage, high energy transients. They have excellent clamping capability, high surge capability, low zener impedance and fast response time. The SMB series is supplied in ON Semiconductor?s exclusive, cost-effective, highly reliable SURMETIC? package and is ideally suited for use in communication systems, automotive, numerical controls, process controls, medical equipment, business machines, power supplies and many other industrial/consumer applications. http://www.onsemi.com/pub_link/Collateral/P6SMB6.8AT3-D.PDF <datasheet.pdf>
D4 = Heinrich:Z-DIODE; SPICEPREFIX: D
IC1 = Heinrich:AT90CAN128
IC2 = Heinrich:AVR-JTAG
IC3 = Heinrich:TJA1050
IC4 = Heinrich:ADR01_02_03
IC5 = Heinrich:TLS115B0EJXUMA1: INFINEON - TLS115B0EJXUMA1 - LINEAR VOLTAGE REGULATOR Source: Datasheet <https://datasheet.datasheetarchive.com/originals/distributors/DKDS-40/45612.pdf>; ARROW_PART_NUMBER: TLS115B0EJXUMA1; ARROW_PRICE-STOCK: https://www.arrow.com/en/products/tls115b0ejxuma1/infineon-technologies-ag; DESCRIPTION: INFINEON - TLS115B0EJXUMA1 - LINEAR VOLTAGE REGULATOR; HEIGHT: 1.7mm; MANUFACTURER_NAME: Infineon; MANUFACTURER_PART_NUMBER: TLS115B0EJXUMA1; MOUSER_PART_NUMBER: 726-TLS115B0EJXUMA1; MOUSER_PRICE-STOCK: https://www.mouser.co.uk/ProductDetail/Infineon-Technologies/TLS115B0EJXUMA1?qs=Qyx3PVvfm669%2FyRQa%2FG9Ew%3D%3D
IC6 = Heinrich:TLE42754
IC7 IC9 = Heinrich:CJ125_QFP32: Bosch CJ125 Lambda Controller IC in QFP32 Package
IC8 = Heinrich:BM2LB150FJ-CE2: Power Switch ICs - Power Distribution Automotive IPD 2ch Low Side Switch
IC10 IC12 = Heinrich:ADS1015BQDGSRQ1: Automotive 12-Bit 3.3kSPS 4-Ch Delta-Sigma ADC With PGA, Oscillator, VREF, Comparator, and I2C Source: Datasheet <http://www.ti.com/lit/gpn/ads1015-q1>; ARROW_PART_NUMBER: ADS1015BQDGSRQ1; ARROW_PRICE-STOCK: https://www.arrow.com/en/products/ads1015bqdgsrq1/texas-instruments.html?utm_currency=USD&region=nac; DESCRIPTION: Automotive 12-Bit 3.3kSPS 4-Ch Delta-Sigma ADC With PGA, Oscillator, VREF, Comparator, and I2C; HEIGHT: 1.1mm; MANUFACTURER_NAME: Texas Instruments; MANUFACTURER_PART_NUMBER: ADS1015BQDGSRQ1; MOUSER_PART_NUMBER: 595-ADS1015BQDGSRQ1; MOUSER_PRICE-STOCK: https://www.mouser.co.uk/ProductDetail/Texas-Instruments/ADS1015BQDGSRQ1?qs=34RfhUjJmKfZv563%2FD593g%3D%3D
IC11 = Heinrich:AD5337BRMZ: 8 Bit Digital to Analog Converter 2 8-MSOP ,2.5V ~ 5.5V,-40C ~ 105C Source: Datasheet <https://www.analog.com/media/en/technical-documentation/data-sheets/ad5337_5338_5339.pdf>; ARROW_PART_NUMBER: AD5337BRMZ; ARROW_PRICE-STOCK: https://www.arrow.com/en/products/ad5337brmz/analog-devices?region=europe; DESCRIPTION: 8 Bit Digital to Analog Converter 2 8-MSOP ,2.5V ~ 5.5V,-40C ~ 105C; HEIGHT: 1.1mm; MANUFACTURER_NAME: Analog Devices; MANUFACTURER_PART_NUMBER: AD5337BRMZ; MOUSER_PART_NUMBER: 584-AD5337BRMZ; MOUSER_PRICE-STOCK: https://www.mouser.co.uk/ProductDetail/Analog-Devices/AD5337BRMZ?qs=NmRFExCfTkF7stbfmqVvjw%3D%3D
J1 = Heinrich:ATM13-12PX-12PX-BMXX
JP1 = Heinrich:PINHD-1X3
Q1 = Heinrich:ABM7: ABRACON - ABM7 CRYSTAL Package size: 6x3.5mm Source: Datasheet <http://www.abracon.com/Resonators/abm7.pdf>
Q2 = EmbeddedProjectsBauteile:BSS123: N-CHANNEL MOS FET; EP: 400196
Q3 = microbuilder:MOSFET-P: P-Channel Mosfet SOT-23 NTR0202PL 20V 400mA - Digikey: NTR0202PLT1GOSTR-ND NTR4101PT1G 20V 1.8A - Digikey: NTR4101PT1GOSCT-ND
R1-R32 = rcl:R-EU_: RESISTOR, European symbol; SPICEPREFIX: R